# Altium project STM32_Battery_Management_System.PrjPcb (part 2 of 2)
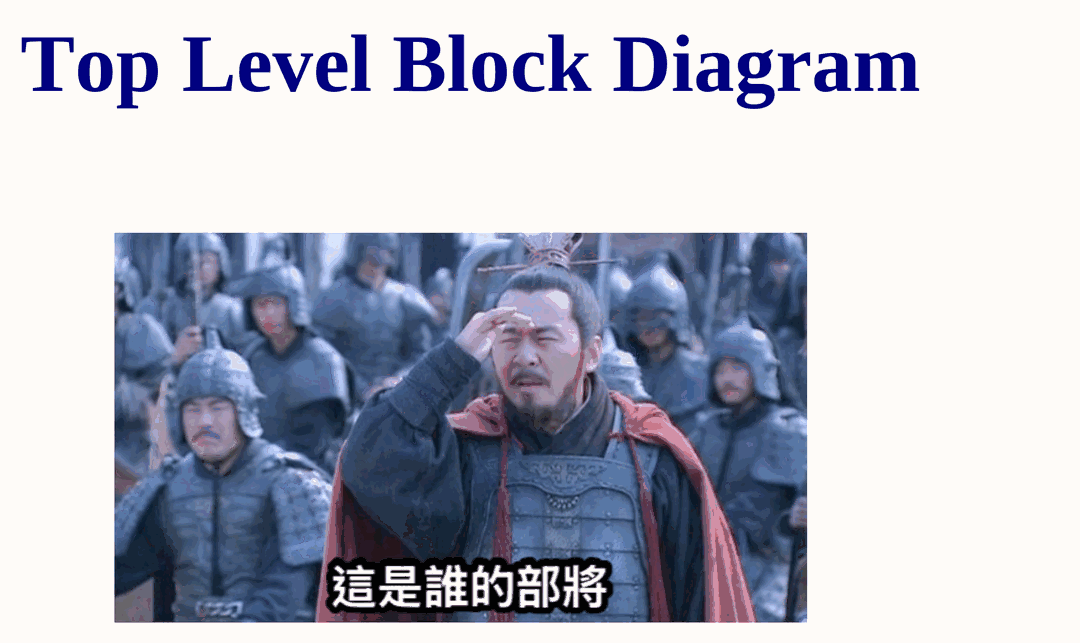
[diagram p6: TopLevel.SchDoc]

## Nets that join several sheets
+3V3: Microcontroller (30 pins), L9963E_BMS_IC (16 pins), Power_Management (C66.2 R42.1 TP3V3.1 U8.5)
+3V3A: Microcontroller (5 pins), Power_Management (C56.2 FB2.2 R36.1 TP3V3A.1)
GND: Microcontroller (54 pins), L9963E_BMS_IC (60 pins), Power_Management (13 pins)
VREG: L9963E_BMS_IC (7 pins), Power_Management (10 pins)
FAULTH_L_MCU: Microcontroller (U2.85), L9963E_BMS_IC (Q6.3 R18.1)
FAULTL_L_MCU: Microcontroller (U2.83), L9963E_BMS_IC (Q7.3 R39.1)
PWM1: Microcontroller (U2.121), L9963E_BMS_IC (Q5.1 R49.2)
PWM2: Microcontroller (U2.122), L9963E_BMS_IC (Q4.1 R48.2)
SPI3_CS: Microcontroller (U2.103), L9963E_BMS_IC (U5.4)
SPI3_MISO: Microcontroller (U2.101), L9963E_BMS_IC (Q3.3 R12.1)
SPI3_MOSI: Microcontroller (U2.102), L9963E_BMS_IC (U5.3)
SPI3_SCLK: Microcontroller (U2.100), L9963E_BMS_IC (U5.1)